# Altium project openEPS.PrjPcb (part 1 of 5)
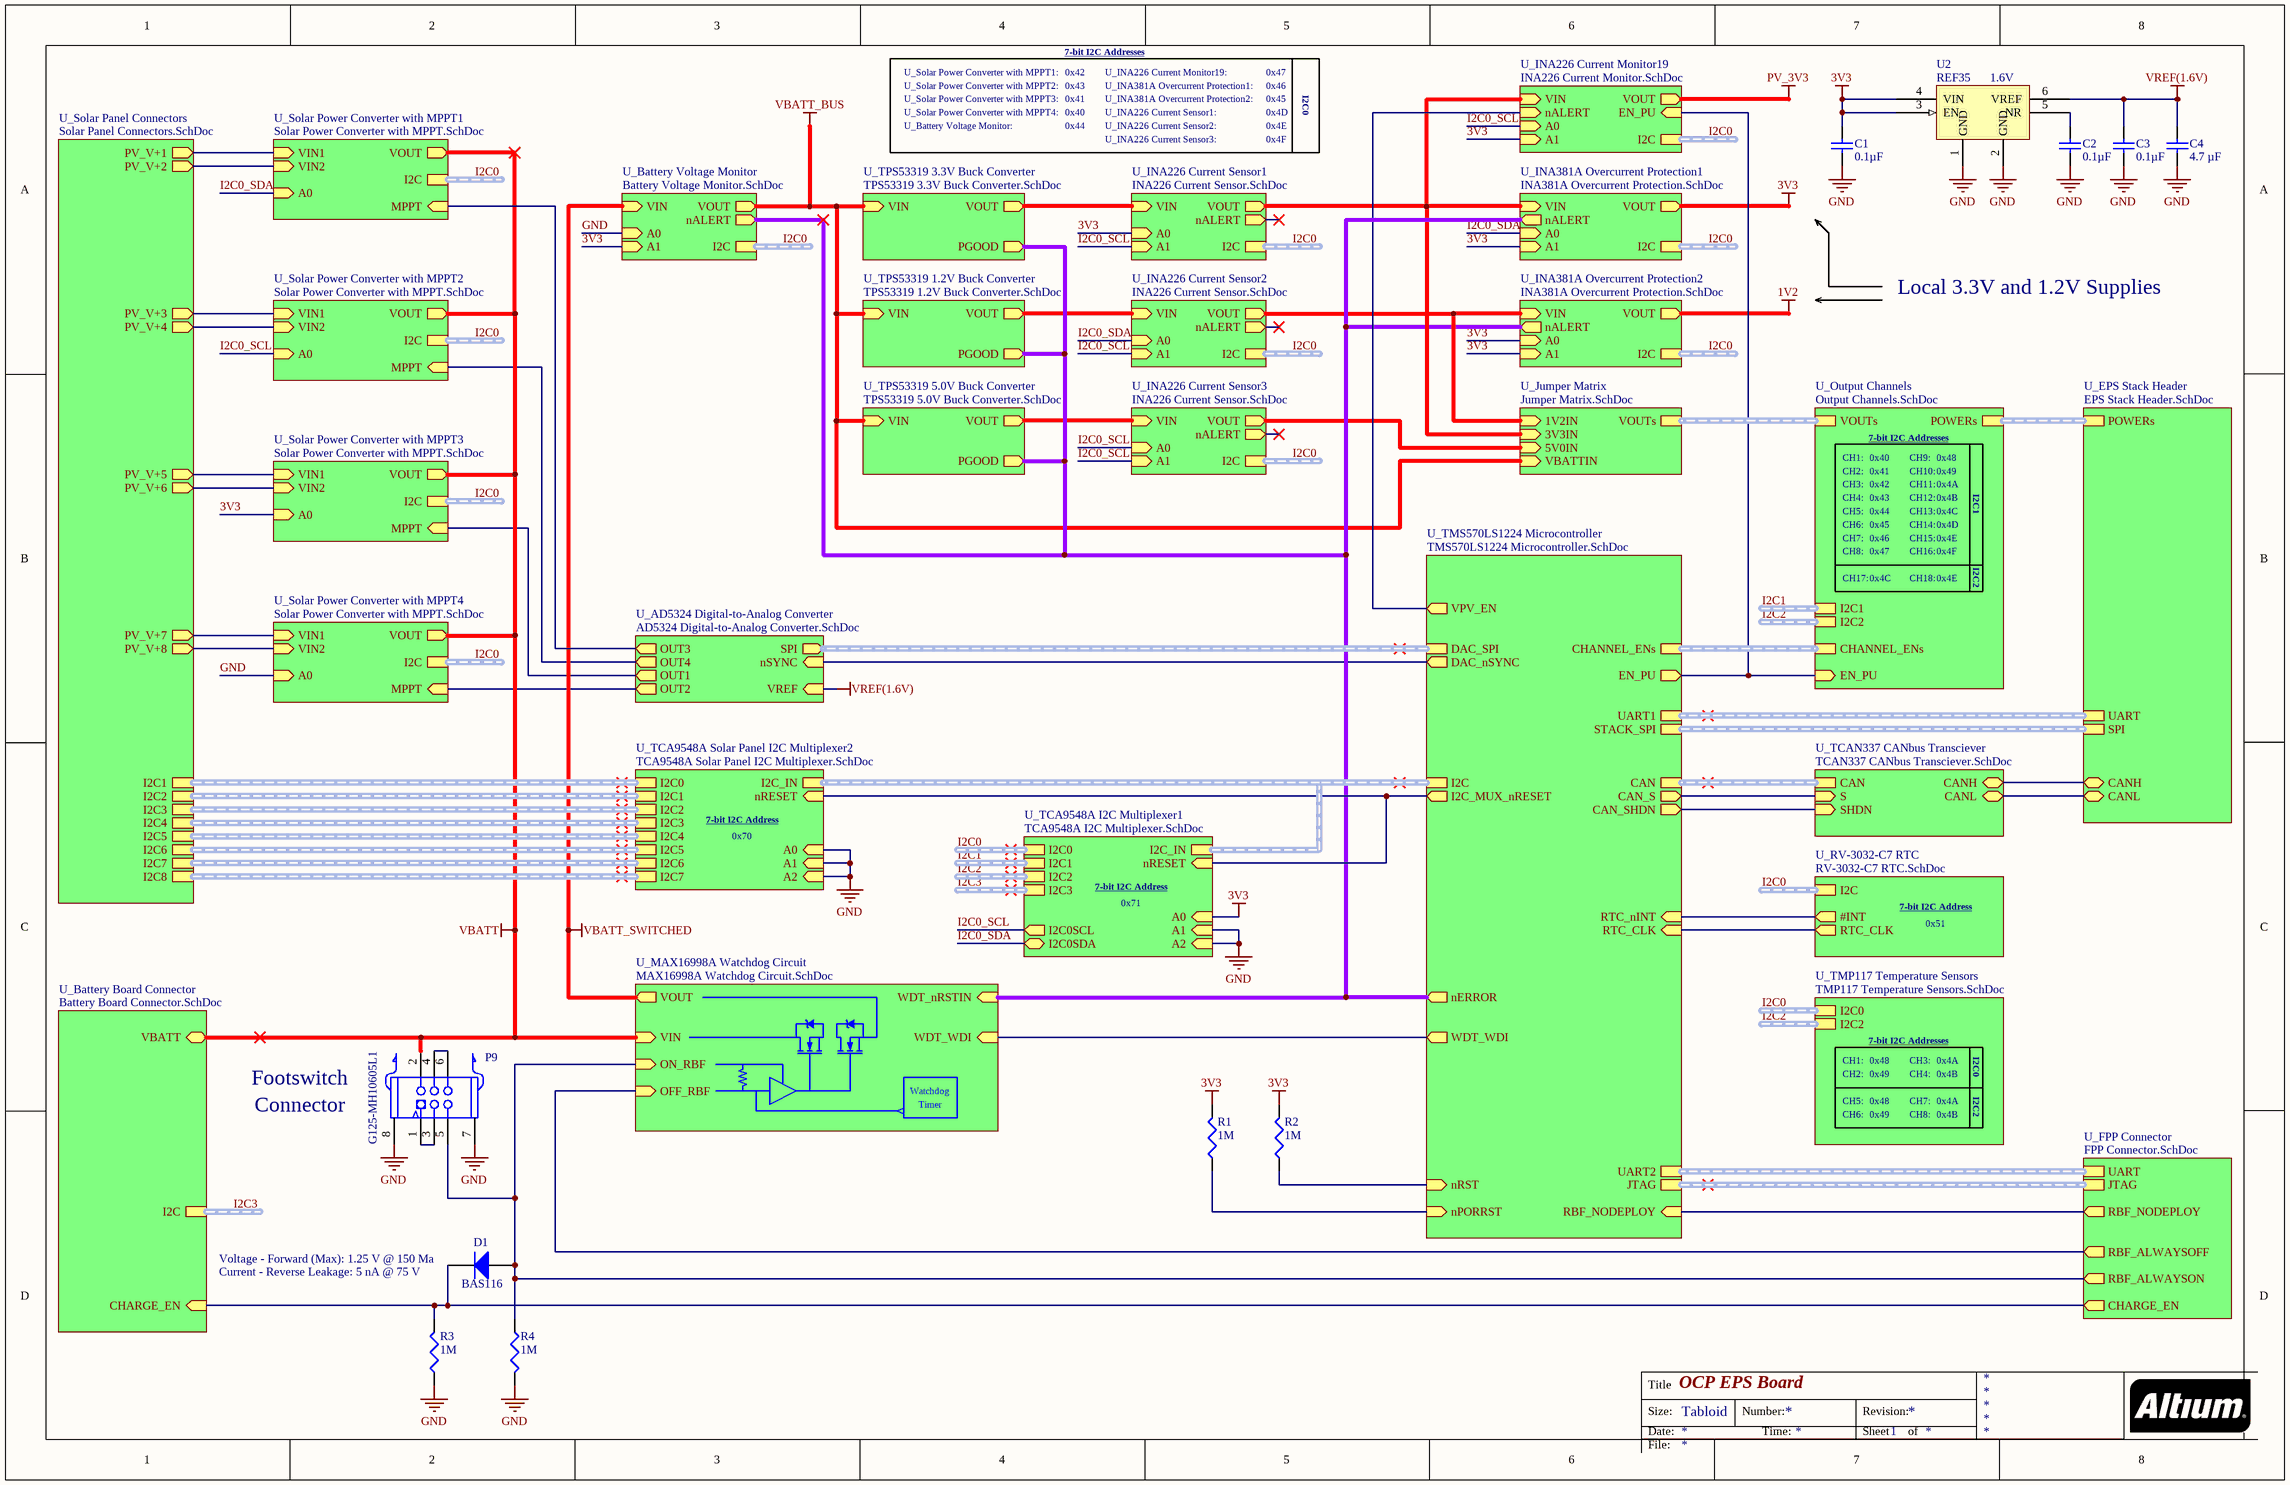
[diagram p0: openEPS.SchDoc]
24 sheets, 564 parts. Net scope: hierarchical (ports join the sheet entries above them; power ports are global).
Board file: openEPS.PcbDoc
Sheets:
  openEPS.SchDoc
    U_Output Channels = Output Channels.SchDoc
      U_INA226 Current Monitor1 = INA226 Current Monitor.SchDoc
      U_INA226 Current Monitor2 = INA226 Current Monitor.SchDoc
      U_INA226 Current Monitor3 = INA226 Current Monitor.SchDoc
      U_INA226 Current Monitor4 = INA226 Current Monitor.SchDoc
      U_INA226 Current Monitor5 = INA226 Current Monitor.SchDoc
      U_INA226 Current Monitor6 = INA226 Current Monitor.SchDoc
      U_INA226 Current Monitor7 = INA226 Current Monitor.SchDoc
      U_INA226 Current Monitor8 = INA226 Current Monitor.SchDoc
      U_INA226 Current Monitor9 = INA226 Current Monitor.SchDoc
      U_INA226 Current Monitor10 = INA226 Current Monitor.SchDoc
      U_INA226 Current Monitor11 = INA226 Current Monitor.SchDoc
      U_INA226 Current Monitor12 = INA226 Current Monitor.SchDoc
      U_INA226 Current Monitor13 = INA226 Current Monitor.SchDoc
      U_INA226 Current Monitor14 = INA226 Current Monitor.SchDoc
      U_INA226 Current Monitor15 = INA226 Current Monitor.SchDoc
      U_INA226 Current Monitor16 = INA226 Current Monitor.SchDoc
      U_INA226 Current Monitor17 = INA226 Current Monitor.SchDoc
      U_INA226 Current Monitor18 = INA226 Current Monitor.SchDoc
    U_Jumper Matrix = Jumper Matrix.SchDoc
    U_TCAN337 CANbus Transciever = TCAN337 CANbus Transciever.SchDoc
    U_INA381A Overcurrent Protection2 = INA381A Overcurrent Protection.SchDoc
    U_INA381A Overcurrent Protection1 = INA381A Overcurrent Protection.SchDoc
    U_INA226 Current Monitor19 = INA226 Current Monitor.SchDoc
    U_EPS Stack Header = EPS Stack Header.SchDoc
    U_AD5324 Digital-to-Analog Converter = AD5324 Digital-to-Analog Converter.SchDoc
    U_TPS53319 1.2V Buck Converter = TPS53319 1.2V Buck Converter.SchDoc
    U_TPS53319 3.3V Buck Converter = TPS53319 3.3V Buck Converter.SchDoc
    U_TPS53319 5.0V Buck Converter = TPS53319 5.0V Buck Converter.SchDoc
    U_MAX16998A Watchdog Circuit = MAX16998A Watchdog Circuit.SchDoc
    U_RV-3032-C7 RTC = RV-3032-C7 RTC.SchDoc
    U_INA226 Current Sensor1 = INA226 Current Sensor.SchDoc
    U_INA226 Current Sensor2 = INA226 Current Sensor.SchDoc
    U_INA226 Current Sensor3 = INA226 Current Sensor.SchDoc
    U_TCA9548A Solar Panel I2C Multiplexer2 = TCA9548A Solar Panel I2C Multiplexer.SchDoc
    U_Solar Panel Connectors = Solar Panel Connectors.SchDoc
    U_Solar Power Converter with MPPT1 = Solar Power Converter with MPPT.SchDoc
      U_LTC3119 Buck Boost Converter = LTC3119 Buck Boost Converter.SchDoc
    U_Solar Power Converter with MPPT2 = Solar Power Converter with MPPT.SchDoc
      U_LTC3119 Buck Boost Converter = LTC3119 Buck Boost Converter.SchDoc
    U_Solar Power Converter with MPPT3 = Solar Power Converter with MPPT.SchDoc
      U_LTC3119 Buck Boost Converter = LTC3119 Buck Boost Converter.SchDoc
    U_Solar Power Converter with MPPT4 = Solar Power Converter with MPPT.SchDoc
      U_LTC3119 Buck Boost Converter = LTC3119 Buck Boost Converter.SchDoc
    U_TMS570LS1224 Microcontroller = TMS570LS1224 Microcontroller.SchDoc
    U_Battery Voltage Monitor = Battery Voltage Monitor.SchDoc
    U_FPP Connector = FPP Connector.SchDoc
    U_Battery Board Connector = Battery Board Connector.SchDoc
    U_TMP117 Temperature Sensors = TMP117 Temperature Sensors.SchDoc
    U_TCA9548A I2C Multiplexer1 = TCA9548A I2C Multiplexer.SchDoc

## Sheet openEPS.SchDoc: OCP EPS Board
size Tabloid; SheetNumber: 1

### Parts
C1  value 0.1µF  [TDK-CGA2B]  (hidden comment: Cap)
C2  value 0.1µF  [TDK-CGA2B]  (hidden comment: Cap)
C3  value 0.1µF  [TDK-CGA2B]  (hidden comment: Cap)
C4  value 4.7 µF  [MUR-GRM188]  (hidden comment: Cap)
D1  BAS116  Voltage - Forward (Max): 1.25 V @ 150 Ma  Current - Reverse Leakage: 5 nA @ 75 V  [DIOD-DFN1006-2]
P9  G125-MH10605L1  [HWN-G125-MH10605L1]
R1  value 1M  [PANA-ERJ2R]  (hidden comment: Res3)
R2  value 1M  [PANA-ERJ2R]  (hidden comment: Res3)
R3  value 1M  [PANA-ERJ2R]  (hidden comment: Res3)
R4  value 1M  [PANA-ERJ2R]  (hidden comment: Res3)
U2  REF35  value 1.6V  [TI-DBV0006A]

### Sub-sheets
U_AD5324 Digital-to-Analog Converter = AD5324 Digital-to-Analog Converter.SchDoc: SPI (out, harness AD5324_SPI), OUT1 (out), OUT2 (out), nSYNC (in), OUT3 (out), OUT4 (out), VREF (in)
U_Battery Board Connector = Battery Board Connector.SchDoc: CHARGE_EN (in), I2C (harness TMS570_I2C1), VBATT (bidir)
U_Battery Voltage Monitor = Battery Voltage Monitor.SchDoc: VIN (in), VOUT (out), I2C (harness INA226_I2C), A0 (in), A1 (in), nALERT (out)
U_EPS Stack Header = EPS Stack Header.SchDoc: CANH (bidir), CANL (bidir), SPI (harness STACK_SPI), UART (harness STACK_UART), POWERs (harness POWERs)
U_FPP Connector = FPP Connector.SchDoc: JTAG (harness DEBUG_JTAG), RBF_ALWAYSON (out), RBF_ALWAYSOFF (out), RBF_NODEPLOY (out), CHARGE_EN (out), UART (harness UART)
U_INA226 Current Monitor19 = INA226 Current Monitor.SchDoc: VIN (in), VOUT (out), I2C (harness I2C), A0 (in), A1 (in), nALERT (in), EN_PU (in)
U_INA226 Current Sensor1 = INA226 Current Sensor.SchDoc: VIN (in), VOUT (out), I2C (harness I2C), A0 (in), A1 (in), nALERT (out)
U_INA226 Current Sensor2 = INA226 Current Sensor.SchDoc: VIN (in), VOUT (out), I2C (harness I2C), A0 (in), A1 (in), nALERT (out)
U_INA226 Current Sensor3 = INA226 Current Sensor.SchDoc: VIN (in), VOUT (out), I2C (harness INA226_I2C), A0 (in), A1 (in), nALERT (out)
U_INA381A Overcurrent Protection1 = INA381A Overcurrent Protection.SchDoc: VIN (in), VOUT (out), I2C (harness I2C), A0 (in), A1 (in), nALERT (out)
U_INA381A Overcurrent Protection2 = INA381A Overcurrent Protection.SchDoc: VIN (in), VOUT (out), I2C (harness INA226_I2C), A0 (in), A1 (in), nALERT (out)
U_Jumper Matrix = Jumper Matrix.SchDoc: 3V3IN (in), VBATTIN (in), 1V2IN (in), 5V0IN (in), VOUTs (harness VOUTs)
U_MAX16998A Watchdog Circuit = MAX16998A Watchdog Circuit.SchDoc: WDT_WDI (in), WDT_nRSTIN (in), ON_RBF (in), VOUT (out), VIN (in), OFF_RBF (in)
U_Output Channels = Output Channels.SchDoc: CHANNEL_ENs (harness CHANNEL_ENs), VOUTs (harness VOUTs), POWERs (harness POWERs), EN_PU (in), I2C2 (harness LTC4316_I2CIN), I2C1 (harness LTC4316_I2CIN)
U_RV-3032-C7 RTC = RV-3032-C7 RTC.SchDoc: #INT (out), I2C (harness RTCMK_I2C), RTC_CLK (out)
U_Solar Panel Connectors = Solar Panel Connectors.SchDoc: PV_V+1 (out), I2C1 (harness PV_I2C1), I2C2 (harness PV_I2C2), I2C3 (harness PV_I2C3), I2C4 (harness PV_I2C4), I2C5 (harness PV_I2C5), I2C6 (harness PV_I2C6), I2C7 (harness PV_I2C7), I2C8 (harness PV_I2C8), PV_V+2 (out), PV_V+3 (out), PV_V+4 (out), PV_V+5 (out), PV_V+6 (out), PV_V+7 (out), PV_V+8 (out)
U_Solar Power Converter with MPPT1 = Solar Power Converter with MPPT.SchDoc: VIN1 (in), VOUT (out), I2C (harness I2C), A0 (in), MPPT (in), VIN2 (in)
U_Solar Power Converter with MPPT2 = Solar Power Converter with MPPT.SchDoc: VIN1 (in), VOUT (out), I2C (harness I2C), A0 (in), MPPT (in), VIN2 (in)
U_Solar Power Converter with MPPT3 = Solar Power Converter with MPPT.SchDoc: VIN1 (in), VOUT (out), I2C (harness I2C), A0 (in), MPPT (in), VIN2 (in)
U_Solar Power Converter with MPPT4 = Solar Power Converter with MPPT.SchDoc: VIN1 (in), VOUT (out), I2C (harness INA3221_I2C), A0 (in), MPPT (in), VIN2 (in)
U_TCA9548A I2C Multiplexer1 = TCA9548A I2C Multiplexer.SchDoc: I2C1 (harness TCA9548A_I2C1), I2C2 (harness TCA9548A_I2C2), I2C3 (harness TCA9548A_I2C3), I2C_IN (harness TCA9548A_I2CIN), I2C0 (harness TCA9548A_I2C0), A0 (in), A1 (in), A2 (in), nRESET (in), I2C0SCL (out), I2C0SDA (bidir)
U_TCA9548A Solar Panel I2C Multiplexer2 = TCA9548A Solar Panel I2C Multiplexer.SchDoc: I2C1 (harness TCA9548A_I2C1), I2C2 (harness TCA9548A_I2C2), I2C3 (harness TCA9548A_I2C3), I2C4 (harness TCA9548A_I2C4), I2C5 (harness TCA9548A_I2C5), I2C6 (harness TCA9548A_I2C6), I2C7 (harness TCA9548A_I2C7), I2C_IN (harness TCA9548A_I2CIN), I2C0 (harness TCA9548A_I2C0), A0 (in), A1 (in), A2 (in), nRESET (in)
U_TCAN337 CANbus Transciever = TCAN337 CANbus Transciever.SchDoc: CANH (bidir), CANL (bidir), CAN (harness TCAN337_CAN), S (in), SHDN (in)
U_TMP117 Temperature Sensors = TMP117 Temperature Sensors.SchDoc: I2C0 (harness TCA9548A_I2CIN), I2C2 (harness TCA9548A_I2CIN)
U_TMS570LS1224 Microcontroller = TMS570LS1224 Microcontroller.SchDoc: nERROR (out), JTAG (harness TMS570_JTAG), CHANNEL_ENs (harness CHANNEL_ENs), DAC_nSYNC (out), WDT_WDI (out), VPV_EN (out), RTC_nINT (in), I2C (harness I2C), UART1 (harness UART), CAN (harness CAN), STACK_SPI (harness STACK_SPI), DAC_SPI (harness DAC_SPI), nRST (in), RTC_CLK (in), CAN_SHDN (out), CAN_S (out), nPORRST (in), RBF_NODEPLOY (in), EN_PU (out), UART2 (harness UART), I2C_MUX_nRESET (out)
U_TPS53319 1.2V Buck Converter = TPS53319 1.2V Buck Converter.SchDoc: VIN (in), VOUT (out), PGOOD (out)
U_TPS53319 3.3V Buck Converter = TPS53319 3.3V Buck Converter.SchDoc: VIN (in), VOUT (out), PGOOD (out)
U_TPS53319 5.0V Buck Converter = TPS53319 5.0V Buck Converter.SchDoc: VIN (in), VOUT (out), PGOOD (out)

### Nets
3V3: C1.1 R1.1 R2.1 U2.3(EN) U2.4(VIN) ; sheet U_INA381A Overcurrent Protection2/A0, sheet U_INA381A Overcurrent Protection2/A1, sheet U_INA381A Overcurrent Protection1/VOUT, sheet U_INA381A Overcurrent Protection1/A1, sheet U_INA226 Current Monitor19/A1, sheet U_INA226 Current Sensor1/A0, sheet U_Solar Power Converter with MPPT3/A0, sheet U_Battery Voltage Monitor/A1, sheet U_TCA9548A I2C Multiplexer1/A0
GND: C1.2 C2.2 C3.2 C4.1 P9.7 P9.8 R3.1 R4.2 U2.1(GND) U2.2(GND) ; sheet U_TCA9548A Solar Panel I2C Multiplexer2/A0, sheet U_TCA9548A Solar Panel I2C Multiplexer2/A1, sheet U_TCA9548A Solar Panel I2C Multiplexer2/A2, sheet U_Solar Power Converter with MPPT4/A0, sheet U_Battery Voltage Monitor/A0, sheet U_TCA9548A I2C Multiplexer1/A1, sheet U_TCA9548A I2C Multiplexer1/A2
VBATT: P9.2 ; sheet U_MAX16998A Watchdog Circuit/VIN, sheet U_Solar Power Converter with MPPT1/VOUT, sheet U_Solar Power Converter with MPPT2/VOUT, sheet U_Solar Power Converter with MPPT3/VOUT, sheet U_Solar Power Converter with MPPT4/VOUT, sheet U_Battery Board Connector/VBATT
VBATT_BUS: sheet U_Jumper Matrix/VBATTIN, sheet U_TPS53319 1.2V Buck Converter/VIN, sheet U_TPS53319 3.3V Buck Converter/VIN, sheet U_TPS53319 5.0V Buck Converter/VIN, sheet U_Battery Voltage Monitor/VOUT
VBATT_SWITCHED: sheet U_MAX16998A Watchdog Circuit/VOUT, sheet U_Battery Voltage Monitor/VIN
VREF(1.6V): C3.1 C4.2 U2.6(VREF) ; sheet U_AD5324 Digital-to-Analog Converter/VREF
1V2IN: sheet U_Jumper Matrix/1V2IN, sheet U_INA381A Overcurrent Protection2/VIN, sheet U_INA226 Current Sensor2/VOUT
3V3IN: sheet U_Jumper Matrix/3V3IN, sheet U_INA381A Overcurrent Protection1/VIN, sheet U_INA226 Current Monitor19/VIN, sheet U_INA226 Current Sensor1/VOUT
5V0IN: sheet U_Jumper Matrix/5V0IN, sheet U_INA226 Current Sensor3/VOUT
CAN_N: sheet U_TCAN337 CANbus Transciever/CANL, sheet U_EPS Stack Header/CANL
CAN_P: sheet U_TCAN337 CANbus Transciever/CANH, sheet U_EPS Stack Header/CANH
CHARGE_EN: D1.2(K) R3.2 ; sheet U_FPP Connector/CHARGE_EN, sheet U_Battery Board Connector/CHARGE_EN
GIO0: sheet U_TCAN337 CANbus Transciever/SHDN, sheet U_TMS570LS1224 Microcontroller/CAN_SHDN
GIO1: sheet U_MAX16998A Watchdog Circuit/WDT_WDI, sheet U_TMS570LS1224 Microcontroller/WDT_WDI
GIO19: sheet U_RV-3032-C7 RTC/#INT, sheet U_TMS570LS1224 Microcontroller/RTC_nINT
GIO22: sheet U_TMS570LS1224 Microcontroller/RBF_NODEPLOY, sheet U_FPP Connector/RBF_NODEPLOY
GIO23: sheet U_TCA9548A Solar Panel I2C Multiplexer2/nRESET, sheet U_TMS570LS1224 Microcontroller/I2C_MUX_nRESET, sheet U_TCA9548A I2C Multiplexer1/nRESET
GIO26: sheet U_AD5324 Digital-to-Analog Converter/nSYNC, sheet U_TMS570LS1224 Microcontroller/DAC_nSYNC
GIO27: sheet U_Output Channels/EN_PU, sheet U_INA226 Current Monitor19/EN_PU, sheet U_TMS570LS1224 Microcontroller/EN_PU
GIO30: sheet U_TCAN337 CANbus Transciever/S, sheet U_TMS570LS1224 Microcontroller/CAN_S
GIO31: sheet U_INA226 Current Monitor19/nALERT, sheet U_TMS570LS1224 Microcontroller/VPV_EN
I2C0_SCL: sheet U_INA226 Current Monitor19/A0, sheet U_INA226 Current Sensor1/A1, sheet U_INA226 Current Sensor2/A1, sheet U_INA226 Current Sensor3/A0, sheet U_INA226 Current Sensor3/A1, sheet U_Solar Power Converter with MPPT2/A0, sheet U_TCA9548A I2C Multiplexer1/I2C0SCL  [project net I2C0.I2C_SCL]
I2C0_SDA: sheet U_INA381A Overcurrent Protection1/A0, sheet U_INA226 Current Sensor2/A0, sheet U_Solar Power Converter with MPPT1/A0, sheet U_TCA9548A I2C Multiplexer1/I2C0SDA  [project net I2C0.I2C_SDA]
RBF_ALWAYSOFF: sheet U_MAX16998A Watchdog Circuit/OFF_RBF, sheet U_FPP Connector/RBF_ALWAYSOFF
RBF_ALWAYSON: D1.1(A) P9.5 R4.1 ; sheet U_MAX16998A Watchdog Circuit/ON_RBF, sheet U_FPP Connector/RBF_ALWAYSON
RTC_CLK: sheet U_RV-3032-C7 RTC/RTC_CLK, sheet U_TMS570LS1224 Microcontroller/RTC_CLK
NetC2_1: C2.1 U2.5(NR)
NetC32_2: sheet U_TPS53319 1.2V Buck Converter/VOUT, sheet U_INA226 Current Sensor2/VIN
NetC44_2: sheet U_TPS53319 3.3V Buck Converter/VOUT, sheet U_INA226 Current Sensor1/VIN
NetC56_2: sheet U_TPS53319 5.0V Buck Converter/VOUT, sheet U_INA226 Current Sensor3/VIN
NetP1_5: sheet U_Solar Panel Connectors/PV_V+1, sheet U_Solar Power Converter with MPPT1/VIN1
NetP2_5: sheet U_Solar Panel Connectors/PV_V+2, sheet U_Solar Power Converter with MPPT1/VIN2
NetP3_5: sheet U_Solar Panel Connectors/PV_V+3, sheet U_Solar Power Converter with MPPT2/VIN1
NetP4_5: sheet U_Solar Panel Connectors/PV_V+4, sheet U_Solar Power Converter with MPPT2/VIN2
NetP5_5: sheet U_Solar Panel Connectors/PV_V+5, sheet U_Solar Power Converter with MPPT3/VIN1
NetP6_5: sheet U_Solar Panel Connectors/PV_V+6, sheet U_Solar Power Converter with MPPT3/VIN2
NetP7_5: sheet U_Solar Panel Connectors/PV_V+7, sheet U_Solar Power Converter with MPPT4/VIN1
NetP8_5: sheet U_Solar Panel Connectors/PV_V+8, sheet U_Solar Power Converter with MPPT4/VIN2
NetP9_1: P9.1 P9.3
NetP9_4: P9.4 P9.6
NetQ1_3: sheet U_AD5324 Digital-to-Analog Converter/OUT2, sheet U_Solar Power Converter with MPPT4/MPPT
NetQ1_6: sheet U_AD5324 Digital-to-Analog Converter/OUT1, sheet U_Solar Power Converter with MPPT3/MPPT
NetQ2_3: sheet U_AD5324 Digital-to-Analog Converter/OUT4, sheet U_Solar Power Converter with MPPT2/MPPT
NetQ2_6: sheet U_AD5324 Digital-to-Analog Converter/OUT3, sheet U_Solar Power Converter with MPPT1/MPPT
NetR1_2: R1.2 ; sheet U_TMS570LS1224 Microcontroller/nPORRST
NetR2_2: R2.2 ; sheet U_TMS570LS1224 Microcontroller/nRST
NetR52_1: sheet U_INA381A Overcurrent Protection2/nALERT, sheet U_INA381A Overcurrent Protection1/nALERT, sheet U_TPS53319 1.2V Buck Converter/PGOOD, sheet U_TPS53319 3.3V Buck Converter/PGOOD, sheet U_TPS53319 5.0V Buck Converter/PGOOD, sheet U_MAX16998A Watchdog Circuit/WDT_nRSTIN, sheet U_TMS570LS1224 Microcontroller/nERROR, sheet U_Battery Voltage Monitor/nALERT

### Buses and harness runs
harness I2C0 = sheet U_Battery Voltage Monitor/I2C
harness I2C0 = sheet U_INA226 Current Monitor19/I2C
harness I2C0 = sheet U_INA226 Current Sensor1/I2C
harness I2C0 = sheet U_INA226 Current Sensor2/I2C
harness I2C0 = sheet U_INA226 Current Sensor3/I2C
harness I2C0 = sheet U_INA381A Overcurrent Protection1/I2C
harness I2C0 = sheet U_INA381A Overcurrent Protection2/I2C
harness I2C0 = sheet U_RV-3032-C7 RTC/I2C
harness I2C0 = sheet U_Solar Power Converter with MPPT1/I2C
harness I2C0 = sheet U_Solar Power Converter with MPPT2/I2C
harness I2C0 = sheet U_Solar Power Converter with MPPT3/I2C
harness I2C0 = sheet U_Solar Power Converter with MPPT4/I2C
harness I2C0 = sheet U_TCA9548A I2C Multiplexer1/I2C0
harness I2C0 = sheet U_TMP117 Temperature Sensors/I2C0
harness I2C1 = sheet U_Output Channels/I2C1
harness I2C1 = sheet U_TCA9548A I2C Multiplexer1/I2C1
harness I2C2 = sheet U_Output Channels/I2C2
harness I2C2 = sheet U_TCA9548A I2C Multiplexer1/I2C2
harness I2C2 = sheet U_TMP117 Temperature Sensors/I2C2
harness I2C3 = sheet U_Battery Board Connector/I2C
harness I2C3 = sheet U_TCA9548A I2C Multiplexer1/I2C3
harness sheet U_AD5324 Digital-to-Analog Converter/SPI = sheet U_TMS570LS1224 Microcontroller/DAC_SPI
harness sheet U_EPS Stack Header/POWERs = sheet U_Output Channels/POWERs
harness sheet U_EPS Stack Header/SPI = sheet U_TMS570LS1224 Microcontroller/STACK_SPI
harness sheet U_EPS Stack Header/UART = sheet U_TMS570LS1224 Microcontroller/UART1
harness sheet U_FPP Connector/JTAG = sheet U_TMS570LS1224 Microcontroller/JTAG
harness sheet U_FPP Connector/UART = sheet U_TMS570LS1224 Microcontroller/UART2
harness sheet U_Jumper Matrix/VOUTs = sheet U_Output Channels/VOUTs
harness sheet U_Output Channels/CHANNEL_ENs = sheet U_TMS570LS1224 Microcontroller/CHANNEL_ENs
harness sheet U_Solar Panel Connectors/I2C1 = sheet U_TCA9548A Solar Panel I2C Multiplexer2/I2C0
harness sheet U_Solar Panel Connectors/I2C2 = sheet U_TCA9548A Solar Panel I2C Multiplexer2/I2C1
harness sheet U_Solar Panel Connectors/I2C3 = sheet U_TCA9548A Solar Panel I2C Multiplexer2/I2C2
harness sheet U_Solar Panel Connectors/I2C4 = sheet U_TCA9548A Solar Panel I2C Multiplexer2/I2C3
harness sheet U_Solar Panel Connectors/I2C5 = sheet U_TCA9548A Solar Panel I2C Multiplexer2/I2C4
harness sheet U_Solar Panel Connectors/I2C6 = sheet U_TCA9548A Solar Panel I2C Multiplexer2/I2C5
harness sheet U_Solar Panel Connectors/I2C7 = sheet U_TCA9548A Solar Panel I2C Multiplexer2/I2C6
harness sheet U_Solar Panel Connectors/I2C8 = sheet U_TCA9548A Solar Panel I2C Multiplexer2/I2C7
harness sheet U_TCA9548A I2C Multiplexer1/I2C_IN = sheet U_TCA9548A Solar Panel I2C Multiplexer2/I2C_IN = sheet U_TMS570LS1224 Microcontroller/I2C
harness sheet U_TCAN337 CANbus Transciever/CAN = sheet U_TMS570LS1224 Microcontroller/CAN

### Notes on the sheet
- U_Solar Power Converter with MPPT1:
- U_Solar Power Converter with MPPT2:
- U_Solar Power Converter with MPPT3:
- 0x41
- 0x42
- 0x43
- 7-bit I2C Addresses
- U_INA226 Current Monitor19:
- U_INA381A Overcurrent Protection1:
- U_INA381A Overcurrent Protection2:
- 0x47
- 0x46
- 0x45
- U_Solar Power Converter with MPPT4:
- U_Battery Voltage Monitor:
- 0x40
- 0x44
- U_INA226 Current Sensor1:
- U_INA226 Current Sensor2:
- U_INA226 Current Sensor3:
- 0x4F
- 0x4E
- 0x4D
- I2C0
- Local 3.3V and 1.2V Supplies
- CH1:
- CH2:
- CH3:
- CH4:
- CH9:
- CH10:
- CH11:
- CH12:
- 0x48
- 0x49
- 0x4A
- 0x4B
- I2C1
- CH5:
- CH6:
- CH7:
- CH8:
- CH13:
- CH14:
- CH15:
- CH16:
- 0x4C
- CH17:
- CH18:
- I2C2
- 7-bit I2C Address
- 0x70
- 0x71
- 0x51
- (near P9) Footswitch
- Watchdog
- Timer
- (near P9) Connector
- Title
- Size:
- Date:
- Tabloid
- Number:
- Time:
- Revision:
- Sheet
- of
- File:

### Library data of the parts
C1-C3 = PC-TDK-02259: CAP CER 0.1UF 50V X7R 0402; Manufacturer Part Number: CGA2B3X7R1H104K050BB; Index: 2259; Designator: C?; Tolerance: ±10%; Published: 2016-03-16; LatestRevisionDate: 2016-03-16; LatestRevisionNote: ...; PackageReference: 0402 (1005 Metric); Publisher: AlbertaSat; PackageDescription: Radial Cap, Thru-Hole; 2 Leads; 0.3 in Pin Spacing; Part Number: PC-TDK-02259; Supplier Part Number 1: 445-6899-1-ND; Supplier 1: Digi-key; Supplier Link: http://www.digikey.ca/product-search/en?keywords=445-6899-1-ND; Voltage - Rated: 50V; Temperature Coefficient: X7R; Applications: Automotive; Operating Temperature: -55°C ~ 125°C
C4 = 10165: CAP CER 4.7UF 16V X7R 0603; Part Number: 10165; Manufacturer Part Number: GRM188Z71C475KE21D; Designator: C?; Tolerance: ±10%; Voltage - Rated: 25V; Published: 8-Jun-2000; LatestRevisionDate: 17-Jul-2002; LatestRevisionNote: Re-released for DXP Platform.; PackageReference: 0603 (1608 Metric); Publisher: Altium Limited; PackageDescription: Chip Capacitor, 2-Leads, Body 1.60x0.80mm, IPC Low Density; Supplier Part Number 1: 490-GRM188Z71C475KE21DCT-ND; Supplier 1: Digi-Key; Supplier Link: #https://www.digikey.ca/en/products/detail/murata-electronics/GRM188Z71C475KE21D/13401930#; Temperature Coefficient: X7R; Application: General Purpose; Operating Temperature: -55°C ~ 125°C; Supplier 2: Mouser; Supplier Part Number 2: 81-GRM188Z71C475KE1D
D1 = 61: DIODE GEN PURP 85V 215MA 2DFN; Part Number: 61; Manufacturer Part Number: BAS116LPH4-7B; Designator: d?; Power - Peak Pulse: 300 mW; Published: 8-Jun-2000; LatestRevisionDate: 17-Jul-2002; LatestRevisionNote: Re-released for DXP Platform.; PackageVersion: Sep-1996; PackageReference: DFN1006; Publisher: Altium Limited; PackageDescription: DO-214-AB/SMC; 2 C-Bend Leads; Body 7.9 x 5.9 mm, inc. leads (LxW); Code_JEDEC: DO-214-AB; Supplier Part Number 1: BAS116LPH4-7BDICT-ND; Supplier 1: Digi-Key; Supplier Part Number 2: 621-BAS116LPH4-7B; Supplier 2: Mouser; Supplier Link: #https://www.digikey.ca/en/products/detail/diodes-incorporated/BAS116LPH4-7B/2755852#; Voltage - Breakdown (Min): 85V; Operating Temperature: -55°C ~ 150°C (TJ)
P9 = PP-HWN-00014: CONN HEADER R/A 6POS 1.25MM; Index: 14; Designator: P?; Part Number: PP-HWN-00014; Manufacturer Part Number: G125-MH10605L1P; Supplier Part Number 1: 952-2695-ND; Supplier 1: Digi-key; Supplier Part Number 2: 855-G125-MH10605L1P; Supplier 2: Mouser; Publisher: AlbertaSat; Published: 2019-07-08; LatestRevisionDate: 2023-05-04; LatestRevisionNote: Added operating temperature; Supplier Link: https://www.digikey.ca/products/en?keywords=952-2695-ND; Operating Temperature: -65°C ~ 150°C
R1-R4 = 19704: RES SMD 1M OHM 1% 1/10W 0402; Part Number: 19704; Manufacturer Part Number: ERJ-2RKF1004X; Designator: R?; Power: 0.1W, 1/10W; Temperature Coefficient: ±100ppm/°C; Published: 8-Jun-2000; LatestRevisionDate: 29-May-2009; LatestRevisionNote: IPC-7351 Footprint Added.; PackageReference: 0402 (1005 Metric); Publisher: Altium Limited; PackageDescription: Chip Resistor, 2-Leads, Body 1.00x0.50mm, IPC Low Density; Supplier Part Number 1: P1.00MLCT-ND; Supplier 1: Digi-Key; Supplier Link: http://www.digikey.ca/product-search/en?keywords=P1.00MLCT-ND; Tolerance: ±1%; Operating Temperature: -55°C ~ 155°C
U2 = 150: 650-NA QUIESCENT CURRENT, 12-PPM; Part Number: 150; Manufacturer Part Number: REF35160QDBVR; Designator: U?; Supplier Part Number 2: 595-REF35160QDBVR; Supplier 2: Mouser; Supplier Part Number 1: 296-REF35160QDBVRCT-ND; Supplier 1: Digi-Key; Supplier Link: https://www.digikey.ca/products/en?keywords=296-REF35160QDBVRCT-ND; PackageReference: SOT-23-6; Operating Temperature: -40°C ~ 125°C (TA)

## Sheet Output Channels.SchDoc: Output Channels
size Letter; SheetNumber: 22
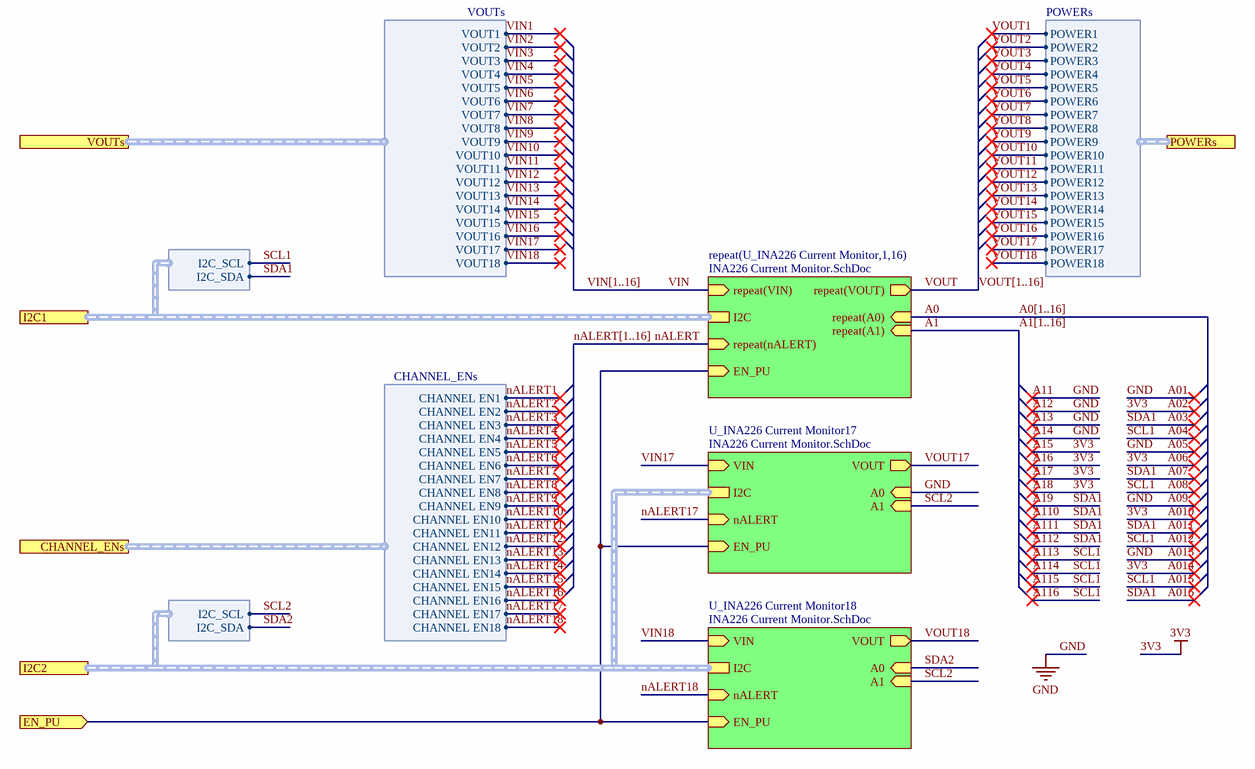
[diagram p1: Output Channels.SchDoc]

### Sub-sheets
repeat(U_INA226 Current Monitor,1,16) = INA226 Current Monitor.SchDoc: repeat(VIN) (in), repeat(VOUT) (out), I2C (harness LTC4316_I2CIN), repeat(A0) (in), repeat(A1) (in), repeat(nALERT) (in), EN_PU (in)
U_INA226 Current Monitor17 = INA226 Current Monitor.SchDoc: VIN (in), VOUT (out), I2C (harness LTC4316_I2CIN), A0 (in), A1 (in), nALERT (in), EN_PU (in)
U_INA226 Current Monitor18 = INA226 Current Monitor.SchDoc: VIN (in), VOUT (out), I2C (harness LTC4316_I2CIN), A0 (in), A1 (in), nALERT (in), EN_PU (in)

### Ports
CHANNEL_ENs (harness CHANNEL_ENs), EN_PU (in), I2C1 (harness LTC4316_I2CIN), I2C2 (harness LTC4316_I2CIN), POWERs (harness POWERs), VOUTs (harness VOUTs)

### Harnesses
LTC4316_I2CIN: I2C_SCL, I2C_SDA
CHANNEL_ENs: CHANNEL EN1, CHANNEL EN2, CHANNEL EN3, CHANNEL EN4, CHANNEL EN5, CHANNEL EN6, CHANNEL EN7, CHANNEL EN8, CHANNEL EN9, CHANNEL EN10, CHANNEL EN11, CHANNEL EN12, CHANNEL EN13, CHANNEL EN14, CHANNEL EN15, CHANNEL EN16, CHANNEL EN17, CHANNEL EN18
VOUTs: VOUT1, VOUT2, VOUT3, VOUT4, VOUT5, VOUT6, VOUT7, VOUT8, VOUT9, VOUT10, VOUT11, VOUT12, VOUT13, VOUT14, VOUT15, VOUT16, VOUT17, VOUT18
POWERs: POWER1, POWER2, POWER3, POWER4, POWER5, POWER6, POWER7, POWER8, POWER9, POWER10, POWER11, POWER12, POWER13, POWER14, POWER15, POWER16, POWER17, POWER18

### Nets
A0: sheet repeat(U_INA226 Current Monitor,1,16)/repeat(A0)
A1: sheet repeat(U_INA226 Current Monitor,1,16)/repeat(A1)
GIO27: port EN_PU, sheet repeat(U_INA226 Current Monitor,1,16)/EN_PU, sheet U_INA226 Current Monitor17/EN_PU, sheet U_INA226 Current Monitor18/EN_PU
nALERT: sheet repeat(U_INA226 Current Monitor,1,16)/repeat(nALERT)
nALERT17: sheet U_INA226 Current Monitor17/nALERT, port CHANNEL_ENs.CHANNEL EN17  [project net GIO35]
nALERT18: sheet U_INA226 Current Monitor18/nALERT, port CHANNEL_ENs.CHANNEL EN18  [project net GIO36]
SCL2: sheet U_INA226 Current Monitor17/A1, sheet U_INA226 Current Monitor18/A1, port I2C2.I2C_SCL  [project net I2C2.I2C_SCL]
SDA2: sheet U_INA226 Current Monitor18/A0, port I2C2.I2C_SDA  [project net I2C2.I2C_SDA]
VIN: sheet repeat(U_INA226 Current Monitor,1,16)/repeat(VIN)
VIN17: sheet U_INA226 Current Monitor17/VIN, port VOUTs.VOUT17
VIN18: sheet U_INA226 Current Monitor18/VIN, port VOUTs.VOUT18
VOUT: sheet repeat(U_INA226 Current Monitor,1,16)/repeat(VOUT)
VOUT17: sheet U_INA226 Current Monitor17/VOUT, port POWERs.POWER17  [project net POWER17]
VOUT18: sheet U_INA226 Current Monitor18/VOUT, port POWERs.POWER18  [project net POWER18]

### Buses and harness runs
bus A0[1..16]
bus A1[1..16]
bus nALERT[1..16]
bus VIN[1..16]
bus VOUT[1..16]
harness port I2C1 = sheet repeat(U_INA226 Current Monitor,1,16)/I2C
harness port I2C2 = sheet U_INA226 Current Monitor17/I2C = sheet U_INA226 Current Monitor18/I2C

### Notes on the sheet
- (the "License"); you may not use or redistribute this file except in compliance with the License. You
- This file and the information within it are licensed under the terms of the Apache License, Version 2.0
- Copyright
- Unless required by applicable law or agreed to in writing, content distributed under the License is
- distributed on an "AS IS" BASIS, WITHOUT WARRANTIES OR CONDITIONS OF ANY KIND,
- either express or implied. See the License for the specific language governing permissions and
- limitations under the License.
- may obtain a copy of the License at:
- http://www.apache.org/licenses/LICENSE-2.0
- Title
- Size:
- Date:
- Letter
- Number:
- Time:
- Revision:
- Sheet
- of
- University of Alberta
- Deptartment of Electrical
- and Computer Engineering
- Edmonton AB, Canada
- T6G 1H9
- File:

## Sheet INA226 Current Monitor.SchDoc: INA226 Current Monitor
size Letter; SheetNumber: 23
Used 19 times, as channels U_Output Channels/U_INA226 Current Monitor1, U_Output Channels/U_INA226 Current Monitor2, U_Output Channels/U_INA226 Current Monitor3, U_Output Channels/U_INA226 Current Monitor4, U_Output Channels/U_INA226 Current Monitor5, U_Output Channels/U_INA226 Current Monitor6, U_Output Channels/U_INA226 Current Monitor7, U_Output Channels/U_INA226 Current Monitor8, U_Output Channels/U_INA226 Current Monitor9, U_Output Channels/U_INA226 Current Monitor10, U_Output Channels/U_INA226 Current Monitor11, U_Output Channels/U_INA226 Current Monitor12, U_Output Channels/U_INA226 Current Monitor13, U_Output Channels/U_INA226 Current Monitor14, U_Output Channels/U_INA226 Current Monitor15, U_Output Channels/U_INA226 Current Monitor16, U_Output Channels/U_INA226 Current Monitor17, U_Output Channels/U_INA226 Current Monitor18, U_INA226 Current Monitor19. Parts and nets are listed once, with the designators drawn on the sheet.
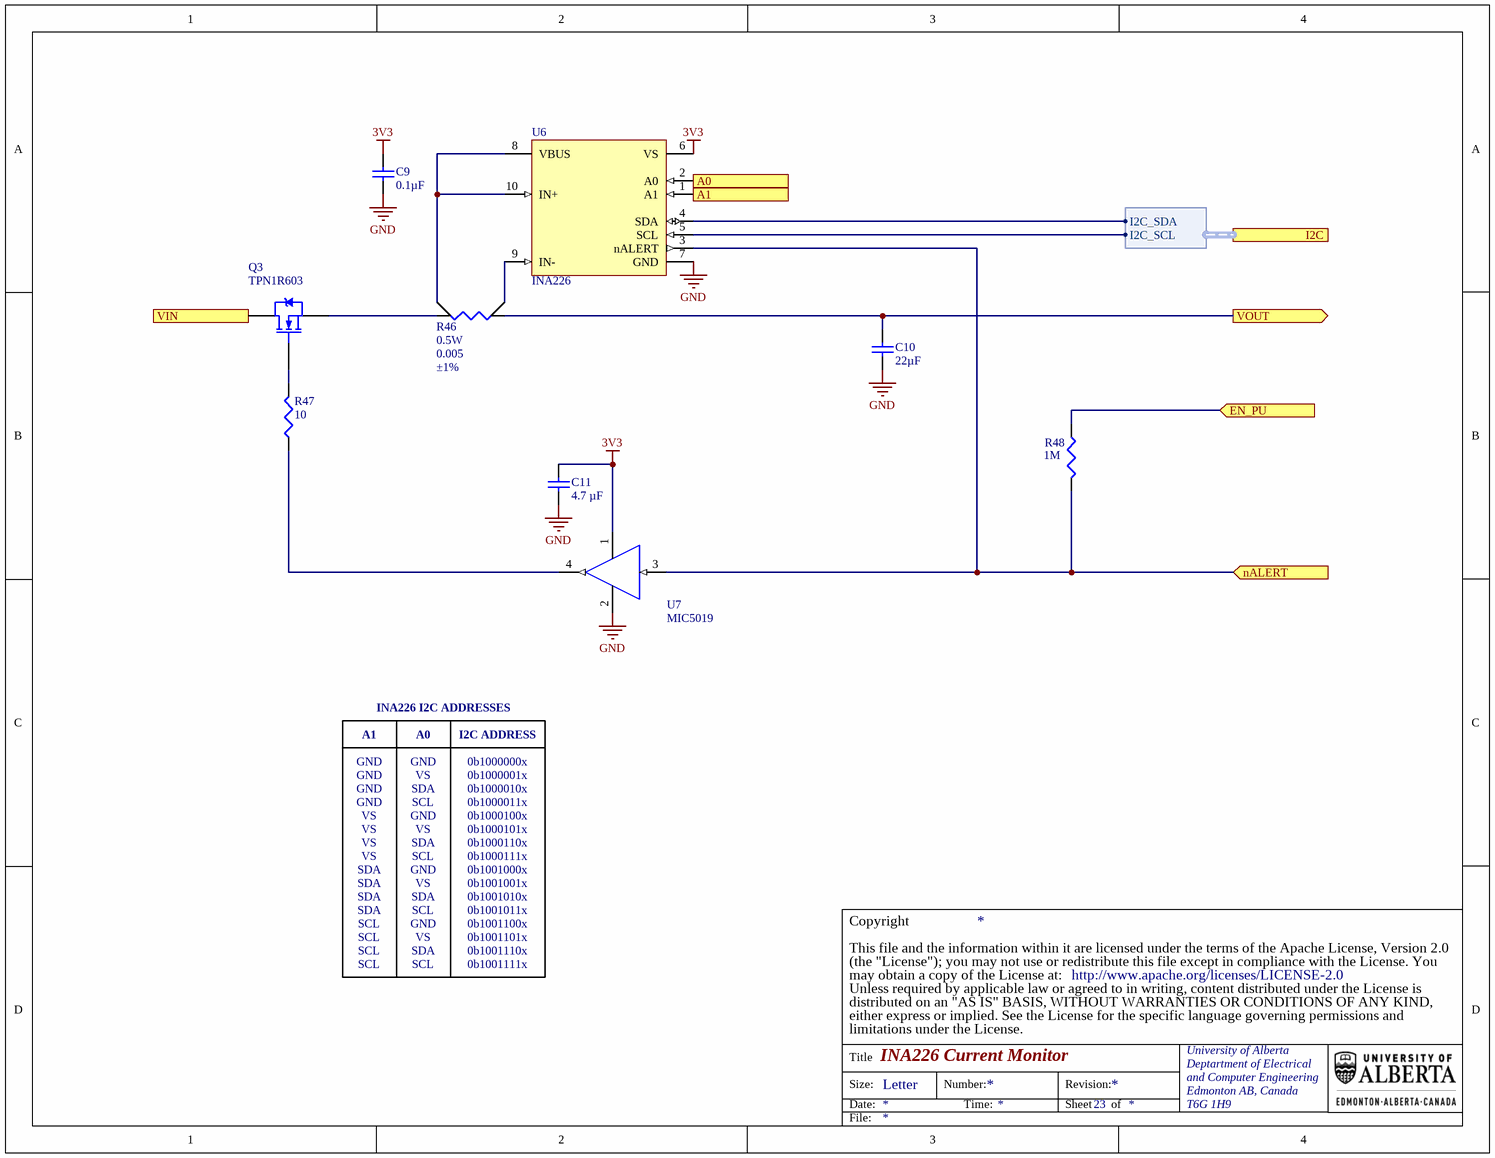
[diagram p2: INA226 Current Monitor.SchDoc]

### Parts
C9  value 0.1µF  [TDK-CGA2B]  (hidden comment: Cap)
C10  value 22µF  [TY-1206L]  (hidden comment: Cap)
C11  value 4.7 µF  [MUR-GRM188]  (hidden comment: Cap)
Q3  TPN1R603  [TOSH-S-3X1S]
R46  value 0.005  Power - Rated: 0.5W  Tolerance: ±1%  [BRN-CRF0805]  (hidden comment: Res Sense)
R47  value 10  [PANA-ERA2A]  (hidden comment: Res3)
R48  value 1M  [PANA-ERJ2R]  (hidden comment: Res3)
U6  INA226  [TI-DGS]
U7  MIC5019  [MCP-MIC5019]

### Ports
A0 (in), A1 (in), EN_PU (in), I2C (harness INA226_I2C), nALERT (in), VIN (in), VOUT (out)

### Harnesses
INA226_I2C: I2C_SCL, I2C_SDA

### Nets
3V3: C9.2 C11.2 U6.6(VS) U7.1(VDD)
GND: C9.1 C10.1 C11.1 U6.7(GND) U7.2(GND)
A0: U6.2(A0) ; port A0
A1: U6.1(A1) ; port A1
EN_PU: R48.2 ; port EN_PU
nALERT: R48.1 U6.3(nALERT) U7.3(IN) ; port nALERT
VIN: Q3.2(D) ; port VIN
VOUT: C10.2 R46.2(I2) ; port VOUT
NetQ3_1: Q3.1(G) R47.2
NetQ3_3: Q3.3(S) R46.1(I1)
NetR46_3: R46.3(S2) U6.9(IN-)
NetR46_4: R46.4(S1) U6.8(VBUS) U6.10(IN+)
NetR47_1: R47.1 U7.4(OUT)
NetU6_4: U6.4(SDA) ; port I2C.I2C_SDA
NetU6_5: U6.5(SCL) ; port I2C.I2C_SCL

### Channels
U_Output Channels/U_INA226 Current Monitor1: designators end in _1; ports A0=GND A1=GND EN_PU=GIO27 nALERT=GIO11 VIN=VIN1 VOUT=POWER1
U_Output Channels/U_INA226 Current Monitor2: designators end in _2; ports A0=3V3 A1=GND EN_PU=GIO27 nALERT=GIO10 VIN=VIN2 VOUT=POWER2
U_Output Channels/U_INA226 Current Monitor3: designators end in _3; ports A0=I2C1.I2C_SDA A1=GND EN_PU=GIO27 nALERT=GIO13 VIN=VIN3 VOUT=POWER3
U_Output Channels/U_INA226 Current Monitor4: designators end in _4; ports A0=I2C1.I2C_SCL A1=GND EN_PU=GIO27 nALERT=GIO12 VIN=VIN4 VOUT=POWER4
U_Output Channels/U_INA226 Current Monitor5: designators end in _5; ports A0=GND A1=3V3 EN_PU=GIO27 nALERT=GIO15 VIN=VIN5 VOUT=POWER5
U_Output Channels/U_INA226 Current Monitor6: designators end in _6; ports A0=3V3 A1=3V3 EN_PU=GIO27 nALERT=GIO14 VIN=VIN6 VOUT=POWER6
U_Output Channels/U_INA226 Current Monitor7: designators end in _7; ports A0=I2C1.I2C_SDA A1=3V3 EN_PU=GIO27 nALERT=GIO21 VIN=VIN7 VOUT=POWER7
U_Output Channels/U_INA226 Current Monitor8: designators end in _8; ports A0=I2C1.I2C_SCL A1=3V3 EN_PU=GIO27 nALERT=GIO20 VIN=VIN8 VOUT=POWER8
U_Output Channels/U_INA226 Current Monitor9: designators end in _9; ports A0=GND A1=I2C1.I2C_SDA EN_PU=GIO27 nALERT=GIO9 VIN=VIN9 VOUT=POWER9
U_Output Channels/U_INA226 Current Monitor10: designators end in _10; ports A0=3V3 A1=I2C1.I2C_SDA EN_PU=GIO27 nALERT=GIO8 VIN=VIN10 VOUT=POWER10
U_Output Channels/U_INA226 Current Monitor11: designators end in _11; ports A0=I2C1.I2C_SDA A1=I2C1.I2C_SDA EN_PU=GIO27 nALERT=GIO6 VIN=VIN11 VOUT=POWER11
U_Output Channels/U_INA226 Current Monitor12: designators end in _12; ports A0=I2C1.I2C_SCL A1=I2C1.I2C_SDA EN_PU=GIO27 nALERT=GIO7 VIN=VIN12 VOUT=POWER12
U_Output Channels/U_INA226 Current Monitor13: designators end in _13; ports A0=GND A1=I2C1.I2C_SCL EN_PU=GIO27 nALERT=GIO3 VIN=VIN13 VOUT=POWER13
U_Output Channels/U_INA226 Current Monitor14: designators end in _14; ports A0=3V3 A1=I2C1.I2C_SCL EN_PU=GIO27 nALERT=GIO4 VIN=VIN14 VOUT=POWER14
U_Output Channels/U_INA226 Current Monitor15: designators end in _15; ports A0=I2C1.I2C_SCL A1=I2C1.I2C_SCL EN_PU=GIO27 nALERT=GIO37 VIN=VIN15 VOUT=POWER15
U_Output Channels/U_INA226 Current Monitor16: designators end in _16; ports A0=I2C1.I2C_SDA A1=I2C1.I2C_SCL EN_PU=GIO27 nALERT=GIO2 VIN=VIN16 VOUT=POWER16
U_Output Channels/U_INA226 Current Monitor17: designators end in _17; ports A0=GND A1=I2C2.I2C_SCL EN_PU=GIO27 nALERT=GIO35 VIN=VIN17 VOUT=POWER17
U_Output Channels/U_INA226 Current Monitor18: designators end in _18; ports A0=I2C2.I2C_SDA A1=I2C2.I2C_SCL EN_PU=GIO27 nALERT=GIO36 VIN=VIN18 VOUT=POWER18
U_INA226 Current Monitor19: designators end in _19; ports A0=I2C0.I2C_SCL A1=3V3 EN_PU=GIO27 nALERT=GIO31 VIN=3V3IN VOUT=PV_3V3

### Notes on the sheet
- INA226 I2C ADDRESSES
- A1
- GND
- A0
- VS
- I2C ADDRESS
- 0b1000000x
- 0b1000001x
- SDA
- SCL
- 0b1000010x
- 0b1000011x
- 0b1000100x
- 0b1000101x
- 0b1000110x
- 0b1000111x
- 0b1001000x
- 0b1001001x
- 0b1001010x
- 0b1001011x
- 0b1001100x
- 0b1001101x
- 0b1001110x
- 0b1001111x
- (the "License"); you may not use or redistribute this file except in compliance with the License. You
- This file and the information within it are licensed under the terms of the Apache License, Version 2.0
- Copyright
- Unless required by applicable law or agreed to in writing, content distributed under the License is
- distributed on an "AS IS" BASIS, WITHOUT WARRANTIES OR CONDITIONS OF ANY KIND,
- either express or implied. See the License for the specific language governing permissions and
- limitations under the License.
- may obtain a copy of the License at:
- http://www.apache.org/licenses/LICENSE-2.0
- Title
- Size:
- Date:
- Letter
- Number:
- Time:
- Revision:
- Sheet
- of
- University of Alberta
- Deptartment of Electrical
- and Computer Engineering
- Edmonton AB, Canada
- T6G 1H9
- File:

### Library data of the parts
C9 = PC-TDK-02259: as C1 on sheet openEPS; Published: 2016-03-16; LatestRevisionDate: 2016-03-16; LatestRevisionNote: ...; PackageReference: 0402 (1005 Metric); Publisher: AlbertaSat; PackageDescription: Radial Cap, Thru-Hole; 2 Leads; 0.3 in Pin Spacing; Part Number: PC-TDK-02259; Supplier Part Number 1: 445-6899-1-ND; Supplier 1: Digi-key; Supplier Link: http://www.digikey.ca/product-search/en?keywords=445-6899-1-ND; Voltage - Rated: 50V; Temperature Coefficient: X7R; Applications: Automotive; Operating Temperature: -55°C ~ 125°C
C10 = PC-TY-00721: CAP CER 22UF 16V X7R 1206; Manufacturer Part Number: EMK316BB7226ML-T; Index: 721; Designator: C?; Tolerance: ±20%; Published: 2016-03-13; LatestRevisionDate: 2016-03-13; LatestRevisionNote: ...; PackageReference: 1206 (3216 Metric); Publisher: AlbertaSat; PackageDescription: Chip Capacitor, 2-Leads, Body 3.20x1.60mm, IPC Low Density; Part Number: PC-TY-00721; Supplier Part Number 1: 587-4319-1-ND; Supplier 1: Digi-key; Supplier Link: http://www.digikey.ca/product-search/en?keywords=587-4319-1-ND; Voltage-Rated: 16V; Temperature Coefficient: X7R; Application: General Purpose; Operating Temperature: -55°C ~ 125°C
C11 = 10165: as C4 on sheet openEPS; Published: 8-Jun-2000; LatestRevisionDate: 17-Jul-2002; LatestRevisionNote: Re-released for DXP Platform.; PackageReference: 0603 (1608 Metric); Publisher: Altium Limited; PackageDescription: Chip Capacitor, 2-Leads, Body 1.60x0.80mm, IPC Low Density; Supplier Part Number 1: 490-GRM188Z71C475KE21DCT-ND; Supplier 1: Digi-Key; Supplier Link: #https://www.digikey.ca/en/products/detail/murata-electronics/GRM188Z71C475KE21D/13401930#; Temperature Coefficient: X7R; Application: General Purpose; Operating Temperature: -55°C ~ 125°C; Supplier 2: Mouser; Supplier Part Number 2: 81-GRM188Z71C475KE1D
Q3 = PU-TOSH-00002: X35 PB-F POWER MOSFET TRANSISTOR; Index: 2; Designator: Q?; Rds On: 1.6mOhm @ 40A, 10V; Part Number: PU-TOSH-00002; Manufacturer Part Number: TPN1R603PL,L1Q; Supplier Part Number 1: TPN1R603PLL1QCT-ND; Supplier 1: Digi-key; Supplier Part Number 2: 757-TPN1R603PLL1Q; Supplier 2: Mouser; Publisher: AlbertaSat; Published: 2020-04-01; LatestRevisionDate: 2020-04-01; LatestRevisionNote: ...; PackageReference: 8-TSON Advance (3.3x3.3); PackageDescription: SON, 8-Leads, Body 3.10x3.10mm, Pitch 0.65mm, Thermal Pad 2.49x2.06mm, IPC Low Density; Supplier Link: #https://www.digikey.ca/product-detail/en/toshiba-semiconductor-and-storage/TPN1R603PL-L1Q/TPN1R603PLL1QCT-ND/6570930#; Operating Temperature: -55°C ~ 175°C (TJ)
R46 = PR-BRN-00023: RES 0.005 OHM 1% 1/2W 0805; Manufacturer Part Number: CRF0805-FZ-R005ELF; Index: 23; Designator: R?; Temperature Coefficient: ±50ppm/°C; Part Number: PR-BRN-00023; Supplier Part Number 1: CRF0805-FZ-R005ELFCT-ND; Supplier 1: Digi-key; Supplier Part Number 2: 652-CRF0805FZR005ELF; Supplier 2: Mouser; Publisher: AlbertaSat; Published: 2022-11-26; LatestRevisionDate: 2023-05-04; LatestRevisionNote: Added operating temperature; PackageReference: BRN-CRF0805; Supplier Link: #https://www.digikey.ca/en/products/detail/bourns-inc/CRF0805-FZ-R005ELF/6210977#; Operating Temperature: -55°C ~ 170°C
R47 = 13235: RES SMD 10 OHM 0.5% 1/16W 0402; Part Number: 13235; Manufacturer Part Number: ERA-2AKD100X; Designator: R?; Power: 0.063W, 1/16W; Temperature Coefficient: ±100ppm/°C; Published: 8-Jun-2000; LatestRevisionDate: 29-May-2009; LatestRevisionNote: IPC-7351 Footprint Added.; PackageReference: 0402 (1005 Metric); Publisher: Altium Limited; PackageDescription: Chip Resistor, 2-Leads, Body 1.00x0.50mm, IPC Low Density; Supplier Part Number 1: P10DDCT-ND; Supplier 1: Digi-Key; Supplier Link: http://www.digikey.ca/product-search/en?keywords=P10DDCT-ND; Tolerance: ±0.5%; Operating Temperature: -55°C ~ 155°C
R48 = 19704: as R1 on sheet openEPS; Published: 8-Jun-2000; LatestRevisionDate: 29-May-2009; LatestRevisionNote: IPC-7351 Footprint Added.; PackageReference: 0402 (1005 Metric); Publisher: Altium Limited; PackageDescription: Chip Resistor, 2-Leads, Body 1.00x0.50mm, IPC Low Density; Supplier Part Number 1: P1.00MLCT-ND; Supplier 1: Digi-Key; Supplier Link: http://www.digikey.ca/product-search/en?keywords=P1.00MLCT-ND; Tolerance: ±1%; Operating Temperature: -55°C ~ 155°C
U6 = 19: IC MONITOR PWR/CURR BIDIR 10MSOP; Part Number: 19; Manufacturer Part Number: INA226AQDGSRQ1; Designator: U?; Supplier Part Number 2: 595-INA226AQDGSRQ1; Supplier 2: Mouser; Supplier Part Number 1: 296-42503-1-ND; Supplier 1: Digi-Key; Supplier Link: #https://www.digikey.com/product-detail/en/texas-instruments/INA226AQDGSRQ1/296-42503-1-ND/5416001#; PackageReference: TI-MSOP10; Operating Temperature: -40°C ~ 125°C
U7 = PU-MCP-00008: IC GATE DRVR HIGH-SIDE 4TQFN; Index: 8; Designator: U?; Part Number: PU-MCP-00008; Manufacturer Part Number: MIC5019YFT-TR; Supplier Part Number 1: 576-4152-1-ND; Supplier 1: Digi-key; Supplier Part Number 2: 998-MIC5019YFTTR; Supplier 2: Mouser; Publisher: AlbertaSat; Published: 2020-04-01; LatestRevisionDate: 2020-04-01; LatestRevisionNote: ...; PackageReference: 4-TQFN (1.2x1.2); Supplier Link: #https://www.digikey.ca/en/products/detail/microchip-technology/MIC5019YFT-TR/3681038#; Operating Temperature: -40°C ~ 125°C (TJ)

## Sheet Jumper Matrix.SchDoc: Jumper Matrix
size Letter; SheetNumber: 19
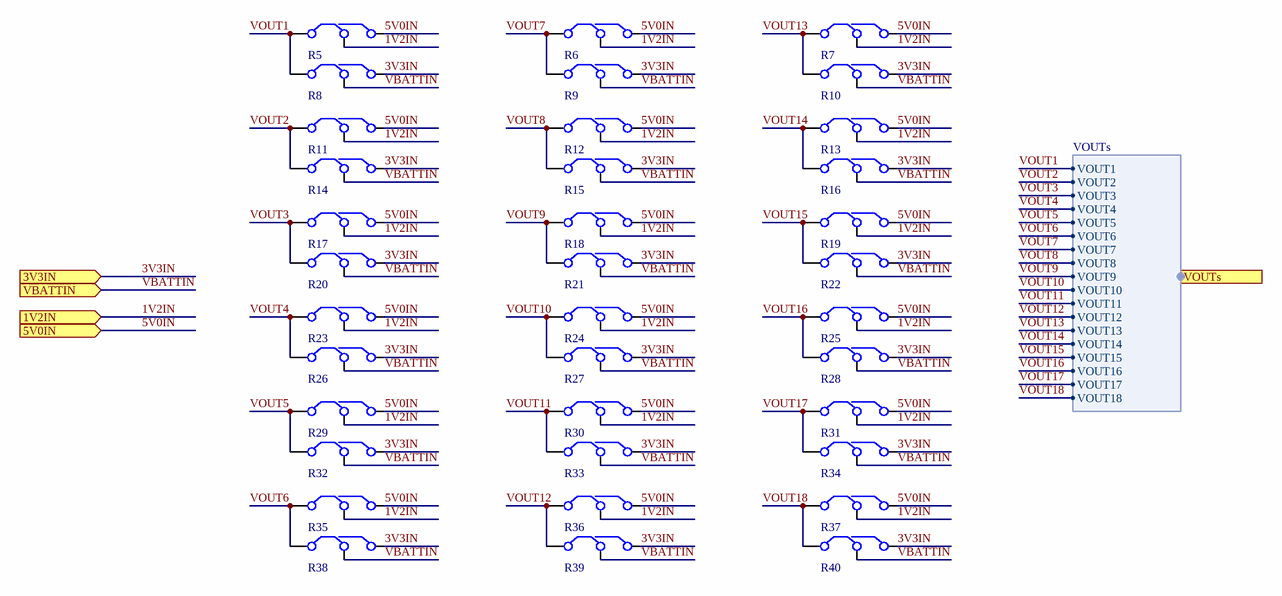
[diagram p3: Jumper Matrix.SchDoc]

### Parts
R5  Jumper  [SKP-RMCF1210orRMCF2010]  (value not drawn)
R6  Jumper  [SKP-RMCF1210orRMCF2010]  (value not drawn)
R7  Jumper  [SKP-RMCF1210orRMCF2010]  (value not drawn)
R8  Jumper  [SKP-RMCF1210orRMCF2010]  (value not drawn)
R9  Jumper  [SKP-RMCF1210orRMCF2010]  (value not drawn)
R10  Jumper  [SKP-RMCF1210orRMCF2010]  (value not drawn)
R11  Jumper  [SKP-RMCF1210orRMCF2010]  (value not drawn)
R12  Jumper  [SKP-RMCF1210orRMCF2010]  (value not drawn)
R13  Jumper  [SKP-RMCF1210orRMCF2010]  (value not drawn)
R14  Jumper  [SKP-RMCF1210orRMCF2010]  (value not drawn)
R15  Jumper  [SKP-RMCF1210orRMCF2010]  (value not drawn)
R16  Jumper  [SKP-RMCF1210orRMCF2010]  (value not drawn)
R17  Jumper  [SKP-RMCF1210orRMCF2010]  (value not drawn)
R18  Jumper  [SKP-RMCF1210orRMCF2010]  (value not drawn)
R19  Jumper  [SKP-RMCF1210orRMCF2010]  (value not drawn)
R20  Jumper  [SKP-RMCF1210orRMCF2010]  (value not drawn)
R21  Jumper  [SKP-RMCF1210orRMCF2010]  (value not drawn)
R22  Jumper  [SKP-RMCF1210orRMCF2010]  (value not drawn)
R23  Jumper  [SKP-RMCF1210orRMCF2010]  (value not drawn)
R24  Jumper  [SKP-RMCF1210orRMCF2010]  (value not drawn)
R25  Jumper  [SKP-RMCF1210orRMCF2010]  (value not drawn)
R26  Jumper  [SKP-RMCF1210orRMCF2010]  (value not drawn)
R27  Jumper  [SKP-RMCF1210orRMCF2010]  (value not drawn)
R28  Jumper  [SKP-RMCF1210orRMCF2010]  (value not drawn)
R29  Jumper  [SKP-RMCF1210orRMCF2010]  (value not drawn)
R30  Jumper  [SKP-RMCF1210orRMCF2010]  (value not drawn)
R31  Jumper  [SKP-RMCF1210orRMCF2010]  (value not drawn)
R32  Jumper  [SKP-RMCF1210orRMCF2010]  (value not drawn)
R33  Jumper  [SKP-RMCF1210orRMCF2010]  (value not drawn)
R34  Jumper  [SKP-RMCF1210orRMCF2010]  (value not drawn)
R35  Jumper  [SKP-RMCF1210orRMCF2010]  (value not drawn)
R36  Jumper  [SKP-RMCF1210orRMCF2010]  (value not drawn)
R37  Jumper  [SKP-RMCF1210orRMCF2010]  (value not drawn)
R38  Jumper  [SKP-RMCF1210orRMCF2010]  (value not drawn)
R39  Jumper  [SKP-RMCF1210orRMCF2010]  (value not drawn)
R40  Jumper  [SKP-RMCF1210orRMCF2010]  (value not drawn)

### Ports
1V2IN (in), 3V3IN (in), 5V0IN (in), VBATTIN (in), VOUTs (harness VOUTs)

### Harnesses
VOUTs: VOUT1, VOUT2, VOUT3, VOUT4, VOUT5, VOUT6, VOUT7, VOUT8, VOUT9, VOUT10, VOUT11, VOUT12, VOUT13, VOUT14, VOUT15, VOUT16, VOUT17, VOUT18

### Nets
VBATTIN: R8.2 R9.2 R10.2 R14.2 R15.2 R16.2 R20.2 R21.2 R22.2 R26.2 R27.2 R28.2 R32.2 R33.2 R34.2 R38.2 R39.2 R40.2 ; port VBATTIN  [project net VBATT_BUS]
1V2IN: R5.2 R6.2 R7.2 R11.2 R12.2 R13.2 R17.2 R18.2 R19.2 R23.2 R24.2 R25.2 R29.2 R30.2 R31.2 R35.2 R36.2 R37.2 ; port 1V2IN
3V3IN: R8.3 R9.3 R10.3 R14.3 R15.3 R16.3 R20.3 R21.3 R22.3 R26.3 R27.3 R28.3 R32.3 R33.3 R34.3 R38.3 R39.3 R40.3 ; port 3V3IN
5V0IN: R5.3 R6.3 R7.3 R11.3 R12.3 R13.3 R17.3 R18.3 R19.3 R23.3 R24.3 R25.3 R29.3 R30.3 R31.3 R35.3 R36.3 R37.3 ; port 5V0IN
VOUT1: R5.1 R8.1 ; port VOUTs.VOUT1  [project net VIN1]
VOUT2: R11.1 R14.1 ; port VOUTs.VOUT2  [project net VIN2]
VOUT3: R17.1 R20.1 ; port VOUTs.VOUT3  [project net VIN3]
VOUT4: R23.1 R26.1 ; port VOUTs.VOUT4  [project net VIN4]
VOUT5: R29.1 R32.1 ; port VOUTs.VOUT5  [project net VIN5]
VOUT6: R35.1 R38.1 ; port VOUTs.VOUT6  [project net VIN6]
VOUT7: R6.1 R9.1 ; port VOUTs.VOUT7  [project net VIN7]
VOUT8: R12.1 R15.1 ; port VOUTs.VOUT8  [project net VIN8]
VOUT9: R18.1 R21.1 ; port VOUTs.VOUT9  [project net VIN9]
VOUT10: R24.1 R27.1 ; port VOUTs.VOUT10  [project net VIN10]
VOUT11: R30.1 R33.1 ; port VOUTs.VOUT11  [project net VIN11]
VOUT12: R36.1 R39.1 ; port VOUTs.VOUT12  [project net VIN12]
VOUT13: R7.1 R10.1 ; port VOUTs.VOUT13  [project net VIN13]
VOUT14: R13.1 R16.1 ; port VOUTs.VOUT14  [project net VIN14]
VOUT15: R19.1 R22.1 ; port VOUTs.VOUT15  [project net VIN15]
VOUT16: R25.1 R28.1 ; port VOUTs.VOUT16  [project net VIN16]
VOUT17: R31.1 R34.1 ; port VOUTs.VOUT17  [project net VIN17]
VOUT18: R37.1 R40.1 ; port VOUTs.VOUT18  [project net VIN18]

### Notes on the sheet
- (the "License"); you may not use or redistribute this file except in compliance with the License. You
- This file and the information within it are licensed under the terms of the Apache License, Version 2.0
- Copyright
- Unless required by applicable law or agreed to in writing, content distributed under the License is
- distributed on an "AS IS" BASIS, WITHOUT WARRANTIES OR CONDITIONS OF ANY KIND,
- either express or implied. See the License for the specific language governing permissions and
- limitations under the License.
- may obtain a copy of the License at:
- http://www.apache.org/licenses/LICENSE-2.0
- Title
- Size:
- Date:
- Letter
- Number:
- Time:
- Revision:
- Sheet
- of
- University of Alberta
- Deptartment of Electrical
- and Computer Engineering
- Edmonton AB, Canada
- T6G 1H9
- File:

### Library data of the parts
R5-R40 = PowerRailSelector: Operating Temperature: -55°C ~ 155°C

## Sheet TCAN337 CANbus Transciever.SchDoc: TCAN337 CANbus Transciever
size Letter; SheetNumber: 18
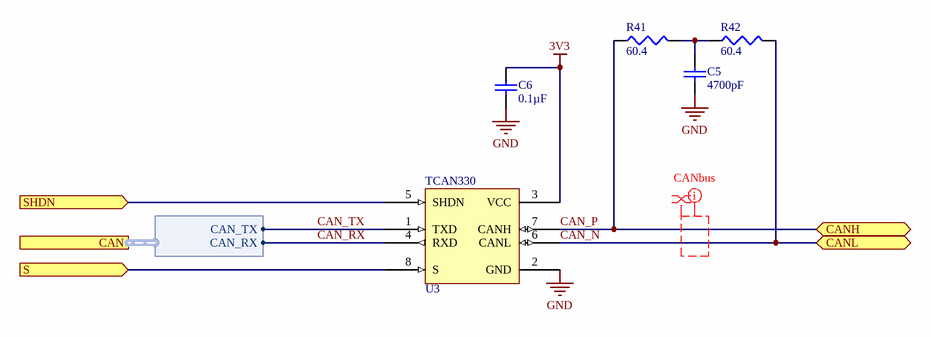
[diagram p4: TCAN337 CANbus Transciever.SchDoc]

### Parts
C5  value 4700pF  [TDK-CGA2B]  (hidden comment: Cap)
C6  value 0.1µF  [TDK-CGA2B]  (hidden comment: Cap)
R41  value 60.4  [PANA-ERA2A]  (hidden comment: Res3)
R42  value 60.4  [PANA-ERA2A]  (hidden comment: Res3)
U3  TCAN330  [TI-R-PDSO-G8]

### Ports
CAN (harness TCAN337_CAN), CANH (bidir), CANL (bidir), S (in), SHDN (in)

### Harnesses
TCAN337_CAN: CAN_RX, CAN_TX

### Nets
3V3: C6.1 U3.3(VCC)
GND: C5.1 C6.2 U3.2(GND)
CAN_N: R42.2 U3.6(CANL) ; port CANL
CAN_P: R41.1 U3.7(CANH) ; port CANH
CAN_RX: U3.4(RXD) ; port CAN.CAN_RX  [project net CAN1_RX]
CAN_TX: U3.1(TXD) ; port CAN.CAN_TX  [project net CAN1_TX]
GIO0: U3.5(SHDN) ; port SHDN
GIO30: U3.8(S) ; port S
NetC5_2: C5.2 R41.2 R42.1

### Layout directives
net class CANbus; rule Impedance Constraint [Min = 120.0    Max = 120.0    ]: (no net found under the mark)
differential pair: (no net found under the mark)

### Notes on the sheet
- (the "License"); you may not use or redistribute this file except in compliance with the License. You
- This file and the information within it are licensed under the terms of the Apache License, Version 2.0
- Copyright
- Unless required by applicable law or agreed to in writing, content distributed under the License is
- distributed on an "AS IS" BASIS, WITHOUT WARRANTIES OR CONDITIONS OF ANY KIND,
- either express or implied. See the License for the specific language governing permissions and
- limitations under the License.
- may obtain a copy of the License at:
- http://www.apache.org/licenses/LICENSE-2.0
- Title
- Size:
- Date:
- Letter
- Number:
- Time:
- Revision:
- Sheet
- of
- University of Alberta
- Deptartment of Electrical
- and Computer Engineering
- Edmonton AB, Canada
- T6G 1H9
- File:

### Library data of the parts
C5 = PC-TDK-01714: CAP CER 4700PF 50V X8R 0402; Manufacturer Part Number: CGA2B2X8R1H472K050BA; Index: 1714; Designator: C?; Tolerance: ±10%; Published: 2016-03-16; LatestRevisionDate: 2016-03-16; LatestRevisionNote: ...; PackageReference: 0402 (1005 Metric); Publisher: AlbertaSat; PackageDescription: Radial Cap, Thru-Hole; 2 Leads; 0.3 in Pin Spacing; Part Number: PC-TDK-01714; Supplier Part Number 1: 445-5883-1-ND; Supplier 1: Digi-key; Supplier Link: http://www.digikey.ca/product-search/en?keywords=445-5883-1-ND; Voltage - Rated: 50V; Temperature Coefficient: X8R; Applications: Automotive; Operating Temperature: -55°C ~ 150°C
C6 = PC-TDK-02259: as C1 on sheet openEPS; Published: 2016-03-16; LatestRevisionDate: 2016-03-16; LatestRevisionNote: ...; PackageReference: 0402 (1005 Metric); Publisher: AlbertaSat; PackageDescription: Radial Cap, Thru-Hole; 2 Leads; 0.3 in Pin Spacing; Part Number: PC-TDK-02259; Supplier Part Number 1: 445-6899-1-ND; Supplier 1: Digi-key; Supplier Link: http://www.digikey.ca/product-search/en?keywords=445-6899-1-ND; Voltage - Rated: 50V; Temperature Coefficient: X7R; Applications: Automotive; Operating Temperature: -55°C ~ 125°C
R41 R42 = 13829: RES SMD 60.4 OHM 0.1% 1/16W 0402; Part Number: 13829; Manufacturer Part Number: ERA-2AEB60R4X; Designator: R?; Power: 0.063W, 1/16W; Temperature Coefficient: ±25ppm/°C; Published: 8-Jun-2000; LatestRevisionDate: 29-May-2009; LatestRevisionNote: IPC-7351 Footprint Added.; PackageReference: 0402 (1005 Metric); Publisher: Altium Limited; PackageDescription: Chip Resistor, 2-Leads, Body 1.00x0.50mm, IPC Low Density; Supplier Part Number 1: P60.4DCCT-ND; Supplier 1: Digi-Key; Supplier Link: http://www.digikey.ca/product-search/en?keywords=P60.4DCCT-ND; Tolerance: ±0.1%; Operating Temperature: -55°C ~ 155°C
U3 = 165: IC TRANSCEIVER 1/1 SOT23-8; Part Number: 165; Manufacturer Part Number: TCAN337GDCNR; Designator: U?; Voltage - Supply: 3V ~ 3.6V; Supplier Part Number 2: 595-TCAN330DCNR; Supplier 2: Mouser; Supplier Part Number 1: 296-46215-1-ND; Supplier 1: Digi-Key; Supplier Link: #https://www.digikey.ca/en/products/detail/texas-instruments/TCAN330DCNR/6572315#; PackageReference: SOT-23-8; Operating Temperature: -40°C ~ 125°C